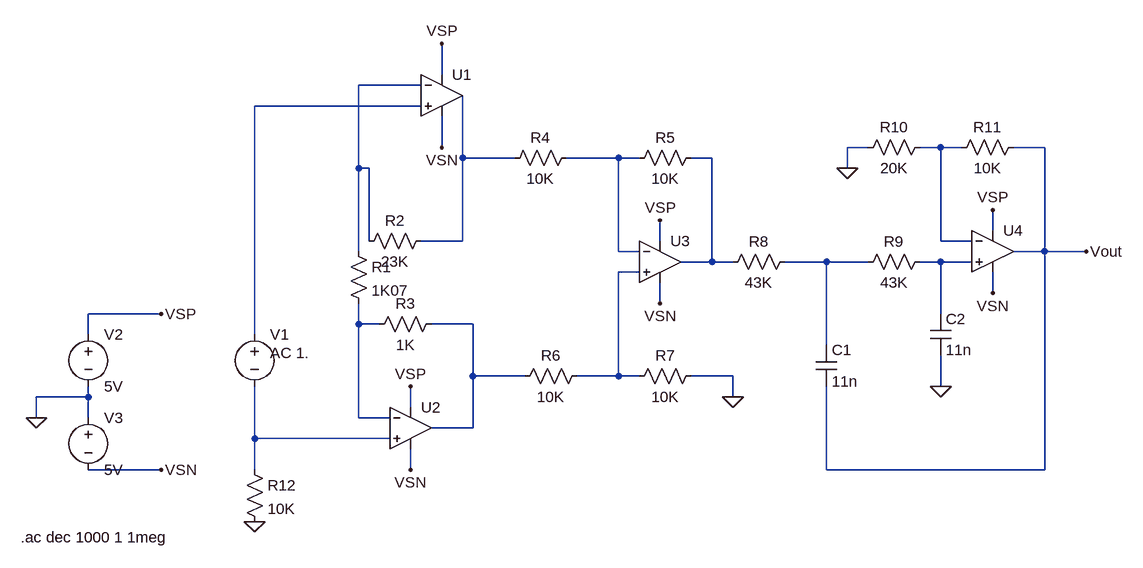
[diagram p0: schematic Schema_proiectEA.asc]
Schema_proiectEA.asc, the LTspice schematic file:
Version 4
SHEET 1 1480 680
WIRE 416 -1072 416 -1120
WIRE 384 -1056 288 -1056
WIRE 384 -1024 128 -1024
WIRE 416 -960 416 -1008
WIRE 1072 -960 1040 -960
WIRE 1184 -960 1152 -960
WIRE 1216 -960 1184 -960
WIRE 1344 -960 1296 -960
WIRE 448 -944 448 -1040
WIRE 528 -944 448 -944
WIRE 688 -944 608 -944
WIRE 720 -944 688 -944
WIRE 832 -944 800 -944
WIRE 288 -928 288 -1056
WIRE 304 -928 288 -928
WIRE 1040 -928 1040 -960
WIRE 1264 -832 1264 -864
WIRE 304 -816 304 -928
WIRE 448 -816 448 -944
WIRE 448 -816 384 -816
WIRE 752 -816 752 -848
WIRE 1184 -816 1184 -960
WIRE 1232 -816 1184 -816
WIRE 288 -800 288 -928
WIRE 688 -800 688 -944
WIRE 720 -800 688 -800
WIRE 1344 -800 1344 -960
WIRE 1344 -800 1296 -800
WIRE 1408 -800 1344 -800
WIRE 832 -784 832 -944
WIRE 832 -784 784 -784
WIRE 864 -784 832 -784
WIRE 1008 -784 944 -784
WIRE 1072 -784 1008 -784
WIRE 1184 -784 1152 -784
WIRE 1232 -784 1184 -784
WIRE 720 -768 688 -768
WIRE 1264 -736 1264 -768
WIRE 752 -720 752 -752
WIRE -16 -704 -128 -704
WIRE 1184 -704 1184 -784
WIRE 288 -688 288 -720
WIRE 320 -688 288 -688
WIRE 464 -688 400 -688
WIRE -128 -672 -128 -704
WIRE 128 -672 128 -1024
WIRE 1008 -656 1008 -784
WIRE 464 -608 464 -688
WIRE 544 -608 464 -608
WIRE 688 -608 688 -768
WIRE 688 -608 624 -608
WIRE 720 -608 688 -608
WIRE 864 -608 800 -608
WIRE 1184 -592 1184 -640
WIRE -128 -576 -128 -592
WIRE -128 -576 -208 -576
WIRE 864 -576 864 -608
WIRE 368 -560 368 -592
WIRE -208 -544 -208 -576
WIRE -128 -544 -128 -576
WIRE 288 -544 288 -688
WIRE 336 -544 288 -544
WIRE 464 -528 464 -608
WIRE 464 -528 400 -528
WIRE 128 -512 128 -592
WIRE 336 -512 128 -512
WIRE -16 -464 -128 -464
WIRE 128 -464 128 -512
WIRE 368 -464 368 -496
WIRE 1008 -464 1008 -592
WIRE 1344 -464 1344 -800
WIRE 1344 -464 1008 -464
FLAG -208 -544 0
FLAG 128 -384 0
FLAG -16 -704 VSP
FLAG -16 -464 VSN
FLAG 368 -592 VSP
FLAG 368 -464 VSN
FLAG 416 -1120 VSP
FLAG 416 -960 VSN
FLAG 752 -848 VSP
FLAG 752 -720 VSN
FLAG 864 -576 0
FLAG 1184 -592 0
FLAG 1040 -928 0
FLAG 1408 -800 Vout
FLAG 1264 -736 VSN
FLAG 1264 -864 VSP
SYMBOL voltage -128 -688 R0
SYMATTR InstName V2
SYMATTR Value 5V
SYMBOL voltage -128 -560 R0
WINDOW 123 0 0 Left 2
WINDOW 39 0 0 Left 2
SYMATTR InstName V3
SYMATTR Value 5V
SYMBOL res 112 -480 R0
SYMATTR InstName R12
SYMATTR Value 10K
SYMBOL voltage 128 -688 R0
WINDOW 3 24 44 Left 2
WINDOW 123 24 44 Left 2
WINDOW 39 0 0 Left 2
SYMATTR Value ""
SYMATTR Value2 AC 1.
SYMATTR InstName V1
SYMBOL res 416 -704 R90
WINDOW 0 0 56 VBottom 2
WINDOW 3 32 56 VTop 2
SYMATTR InstName R3
SYMATTR Value 1K
SYMBOL res 272 -816 R0
SYMATTR InstName R1
SYMATTR Value 1K07
SYMBOL res 400 -832 R90
WINDOW 0 0 56 VBottom 2
WINDOW 3 32 56 VTop 2
SYMATTR InstName R2
SYMATTR Value 23K
SYMBOL res 624 -960 R90
WINDOW 0 0 56 VBottom 2
WINDOW 3 32 56 VTop 2
SYMATTR InstName R4
SYMATTR Value 10K
SYMBOL res 640 -624 R90
WINDOW 0 0 56 VBottom 2
WINDOW 3 32 56 VTop 2
SYMATTR InstName R6
SYMATTR Value 10K
SYMBOL res 816 -960 R90
WINDOW 0 0 56 VBottom 2
WINDOW 3 32 56 VTop 2
SYMATTR InstName R5
SYMATTR Value 10K
SYMBOL res 816 -624 R90
WINDOW 0 0 56 VBottom 2
WINDOW 3 32 56 VTop 2
SYMATTR InstName R7
SYMATTR Value 10K
SYMBOL res 960 -800 R90
WINDOW 0 0 56 VBottom 2
WINDOW 3 32 56 VTop 2
SYMATTR InstName R8
SYMATTR Value 43K
SYMBOL res 1168 -800 R90
WINDOW 0 0 56 VBottom 2
WINDOW 3 32 56 VTop 2
SYMATTR InstName R9
SYMATTR Value 43K
SYMBOL cap 992 -656 R0
SYMATTR InstName C1
SYMATTR Value 11n
SYMBOL cap 1168 -704 R0
SYMATTR InstName C2
SYMATTR Value 11n
SYMBOL res 1168 -976 R90
WINDOW 0 0 56 VBottom 2
WINDOW 3 32 56 VTop 2
SYMATTR InstName R10
SYMATTR Value 20K
SYMBOL res 1312 -976 R90
WINDOW 0 0 56 VBottom 2
WINDOW 3 32 56 VTop 2
SYMATTR InstName R11
SYMATTR Value 10K
SYMBOL Opamps\\UniversalOpamp2 416 -1040 R0
SYMATTR InstName U1
SYMBOL Opamps\\UniversalOpamp2 368 -528 R0
SYMATTR InstName U2
SYMBOL Opamps\\UniversalOpamp2 752 -784 R0
SYMATTR InstName U3
SYMBOL Opamps\\UniversalOpamp2 1264 -800 R0
SYMATTR InstName U4
TEXT -232 -360 Left 2 !.ac dec 1000 1 1meg

The netlist it stands for:
* Schema_proiectEA.asc
V2 VSP 0 5V
V3 0 VSN 5V
R12 N012 0 10K
V1 N002 N012 AC 1.
R3 N011 N010 1K
R1 N001 N010 1K07
R2 N004 N001 23K
R4 N005 N004 10K
R6 N009 N011 10K
R5 N006 N005 10K
R7 0 N009 10K
R8 N007 N006 43K
R9 N008 N007 43K
C1 N007 Vout 11n
C2 N008 0 11n
R10 N003 0 20K
R11 Vout N003 10K
XU1 N002 N001 VSP VSN N004 level.2 Avol=1Meg GBW=10Meg Slew=10Meg ilimit=25m rail=0 Vos=0 phimargin=45 en=0 enk=0 in=0 ink=0 Rin=500Meg  ; pins IN+ IN- V+ V- OUT
XU2 N012 N010 VSP VSN N011 level.2 Avol=1Meg GBW=10Meg Slew=10Meg ilimit=25m rail=0 Vos=0 phimargin=45 en=0 enk=0 in=0 ink=0 Rin=500Meg  ; pins IN+ IN- V+ V- OUT
XU3 N009 N005 VSP VSN N006 level.2 Avol=1Meg GBW=10Meg Slew=10Meg ilimit=25m rail=0 Vos=0 phimargin=45 en=0 enk=0 in=0 ink=0 Rin=500Meg  ; pins IN+ IN- V+ V- OUT
XU4 N008 N003 VSP VSN Vout level.2 Avol=1Meg GBW=10Meg Slew=10Meg ilimit=25m rail=0 Vos=0 phimargin=45 en=0 enk=0 in=0 ink=0 Rin=500Meg  ; pins IN+ IN- V+ V- OUT
.ac dec 1000 1 1meg
.lib UniversalOpamps2.sub
.backanno
.end